# Altium schematic sheet board squematic.SchDoc
size A4; SheetNumber: 1; SheetTotal: 1
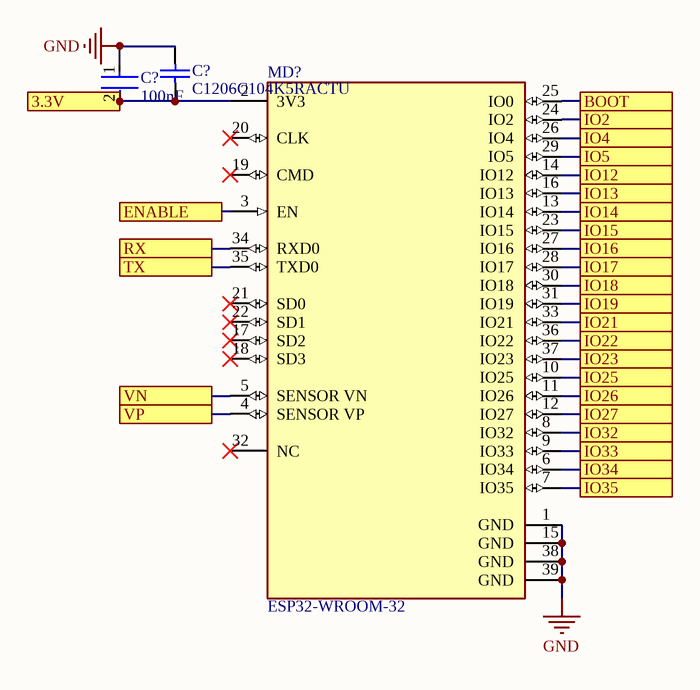
[diagram p0: board squematic.SchDoc]

## Parts
(Parts that share a designator on the sheet are numbered #1, #2 ... from top to bottom, then left to right.)
C?#1  100nF  [FP-C0805C-DN-MFG]
C?#2  C1206C104K5RACTU  [KEMT-1206-2_M]
MD?  ESP32-WROOM-32  [FP-ESP32-WROOM-32-MFG]

## Ports
3.3V, BOOT, ENABLE, IO2, IO4, IO5, IO12, IO13, IO14, IO15, IO16, IO17, IO18, IO19, IO21, IO22, IO23, IO25, IO26, IO27, IO32, IO33, IO34, IO35, RX, TX, VN, VP

## Nets
GND: C?#1.1 C?#2.2 MD?.1(GND) MD?.15(GND) MD?.38(GND) MD?.39(GND)
3.3V: C?#1.2 C?#2.1 MD?.2(3V3) ; port 3.3V
BOOT: MD?.25(IO0) ; port BOOT
ENABLE: MD?.3(EN) ; port ENABLE
IO2: MD?.24(IO2) ; port IO2
IO4: MD?.26(IO4) ; port IO4
IO5: MD?.29(IO5) ; port IO5
IO12: MD?.14(IO12) ; port IO12
IO13: MD?.16(IO13) ; port IO13
IO14: MD?.13(IO14) ; port IO14
IO15: MD?.23(IO15) ; port IO15
IO16: MD?.27(IO16) ; port IO16
IO17: MD?.28(IO17) ; port IO17
IO18: MD?.30(IO18) ; port IO18
IO19: MD?.31(IO19) ; port IO19
IO21: MD?.33(IO21) ; port IO21
IO22: MD?.36(IO22) ; port IO22
IO23: MD?.37(IO23) ; port IO23
IO25: MD?.10(IO25) ; port IO25
IO26: MD?.11(IO26) ; port IO26
IO27: MD?.12(IO27) ; port IO27
IO32: MD?.8(IO32) ; port IO32
IO33: MD?.9(IO33) ; port IO33
IO34: MD?.6(IO34) ; port IO34
IO35: MD?.7(IO35) ; port IO35
RX: MD?.34(RXD0) ; port RX
TX: MD?.35(TXD0) ; port TX
VN: MD?.5(SENSOR_VN) ; port VN
VP: MD?.4(SENSOR_VP) ; port VP

Not connected (* = marked no-connect by the designer): MD? 17(SD2)* 18(SD3)* 19(CMD)* 20(CLK)* 21(SD0)* 22(SD1)* 32(NC)*

## Library data of the parts
C?#1 = CMP-2007-00279-2: CAP CER 0.1UF 50V X7R 0805; Manufacturer Part Number: C0805C104K5RACTU; Manufacturer: KEMET; Value: 0.10 μF; Description: C0805 0.10 μF X7R 30ppm/°C 10.00% 50 V; Tolerance: 0.1; Temperature Coefficient: 30ppm/°C; Material: Ceramic; Device Class L2: Capacitors; Temperature Range Low: -55°C; Voltage Rating: 50 V; Digikey Description: CAP CER 0.1UF 50V X7R 0805; Category: Cap; ComponentLink2Description: Datasheet; Octopart: https://octopart.com/c0805c104k5ractu-kemet-143926; RoHS: TRUE; ComponentLink2URL: https://content.kemet.com/datasheets/KEM_C1003_C0G_SMD.pdf; Temperature Characteristic: X7R; Temperature: -55°C to +125°C; Height: 0.88mm; Temperature Range High: +125°C; Device Class L1: Passive Components; Automotive: No; Lead Free: Yes; Ipc Land Pattern Name: CAPC200125X78; Device Class L3: Ceramic Capacitors; Mouser Description: Cap Ceramic 0.1uF 50V X7R 10% SMD 2.0 x 1.2 mm 125 C Paper T/R; Capacitance: 0.10 μF; Package: C0805C-DN
C?#2 = CMP-1037-04202-2: CAP, Ceramic, 0.1 uF, +/- 10%, 50 V, -55 to 125 degC, 1206 (3216 Metric), RoHS, Tape and Reel; Manufacturer: Kemet; Voltage Rating: 50V; Capacitance: 0.1µF; Product Range: KEMET-CSeries; SVHC: ToBeAdvised; Dielectric Characteristic: X7R; Capacitor Case Style: 1206[3216Metric]; Package Reference: 1206-2; Package Description: 2-Leads SMD, Body 3.2 x 1.6 mm; Packaging: Tape&Reel; Operating Temperature Max: 125degC; Capacitance Tolerance: ±10%; Datasheet URL: https://datasheet.ciiva.com/6125/1725438-6125494.pdf; Manufacturer URL: http://www.kemet.com/; Operating Temperature Min: -55degC; Datasheet Version: Jul-13
MD? = CMP-194065-000008-1: RX TXRX MOD WIFI SURFACE MOUNT; Frequency: 2.5GHz; Sensitivity: -98dBm; Operating Supply Voltage: 3.6V; Data Rate: 150Mbps; Weight: 0.088185oz; Package Quantity: 550; Min Operating Temperature: -40°C; Mount: Surface Mount; Max Operating Temperature: 85°C; Packaging: Cut Tape; Case/Package: SMD/SMT